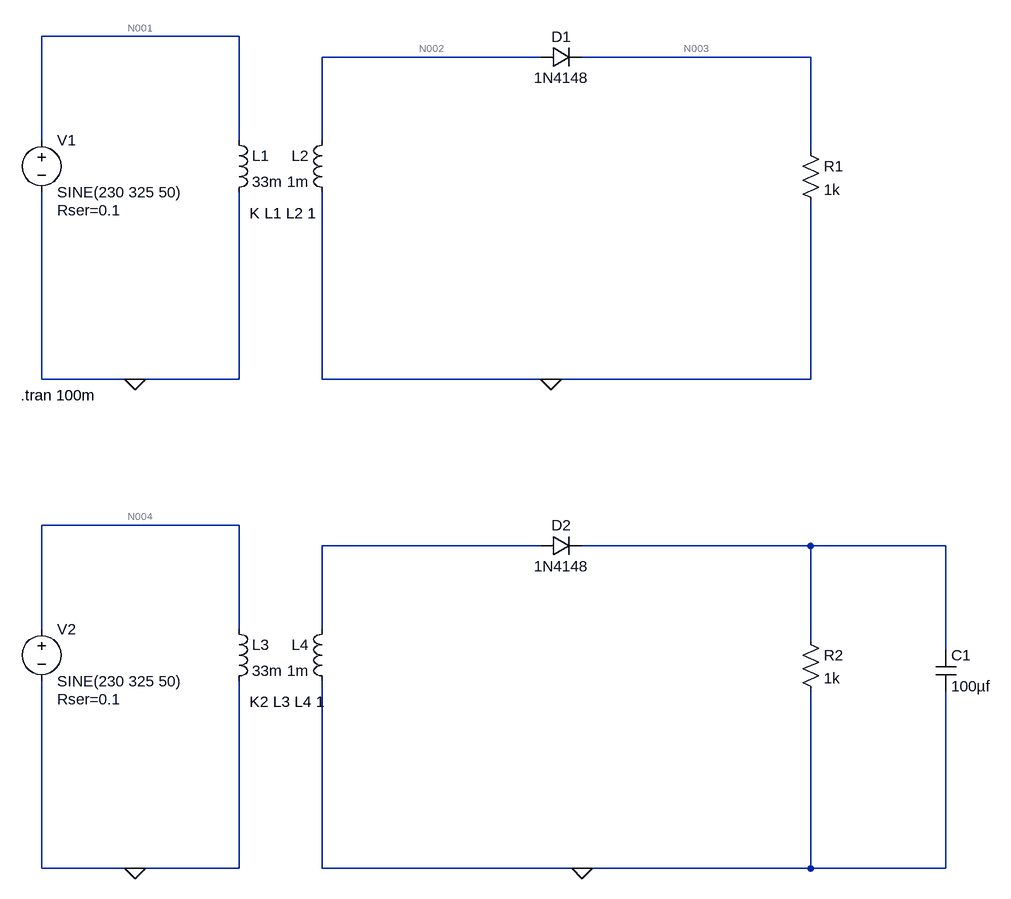
[diagram p0: schematic EXP1.asc]
EXP1.asc, the LTspice schematic file:
Version 4.1
SHEET 1 1164 1272
WIRE -16 -48 -320 -48
WIRE 448 -16 112 -16
WIRE 864 -16 512 -16
WIRE -320 112 -320 -48
WIRE -16 112 -16 -48
WIRE 112 112 112 -16
WIRE 864 128 864 -16
WIRE -320 480 -320 192
WIRE -176 480 -320 480
WIRE -16 480 -16 192
WIRE -16 480 -176 480
WIRE 112 480 112 192
WIRE 464 480 112 480
WIRE 864 480 864 208
WIRE 864 480 464 480
WIRE -16 704 -320 704
WIRE 448 736 112 736
WIRE 864 736 512 736
WIRE 1072 736 864 736
WIRE -320 864 -320 704
WIRE -16 864 -16 704
WIRE 112 864 112 736
WIRE 864 880 864 736
WIRE 1072 896 1072 736
WIRE -320 1232 -320 944
WIRE -176 1232 -320 1232
WIRE -16 1232 -16 944
WIRE -16 1232 -176 1232
WIRE 112 1232 112 944
WIRE 512 1232 112 1232
WIRE 864 1232 864 960
WIRE 864 1232 512 1232
WIRE 1072 1232 1072 960
WIRE 1072 1232 864 1232
FLAG -176 480 0
FLAG -176 1232 0
FLAG 464 480 0
FLAG 512 1232 0
SYMBOL ind -32 96 R0
SYMATTR InstName L1
SYMATTR Value 33m
SYMATTR Type ind
SYMBOL ind 128 96 M0
SYMATTR InstName L2
SYMATTR Value 1m
SYMATTR Type ind
SYMBOL voltage -320 96 R0
WINDOW 123 0 0 Left 0
WINDOW 39 24 124 Left 2
SYMATTR InstName V1
SYMATTR Value SINE(230 325 50)
SYMATTR SpiceLine Rser=0.1
SYMBOL res 848 112 R0
SYMATTR InstName R1
SYMATTR Value 1k
SYMBOL diode 448 0 R270
WINDOW 0 32 32 VTop 2
WINDOW 3 0 32 VBottom 2
SYMATTR InstName D1
SYMATTR Value 1N4148
SYMBOL ind -32 848 R0
SYMATTR InstName L3
SYMATTR Value 33m
SYMATTR Type ind
SYMBOL ind 128 848 M0
SYMATTR InstName L4
SYMATTR Value 1m
SYMATTR Type ind
SYMBOL voltage -320 848 R0
WINDOW 123 0 0 Left 0
WINDOW 39 24 124 Left 2
SYMATTR InstName V2
SYMATTR Value SINE(230 325 50)
SYMATTR SpiceLine Rser=0.1
SYMBOL res 848 864 R0
SYMATTR InstName R2
SYMATTR Value 1k
SYMBOL diode 448 752 R270
WINDOW 0 32 32 VTop 2
WINDOW 3 0 32 VBottom 2
SYMATTR InstName D2
SYMATTR Value 1N4148
SYMBOL cap 1056 896 R0
SYMATTR InstName C1
SYMATTR Value 100µf
TEXT 0 224 Left 2 !K L1 L2 1
TEXT -352 504 Left 2 !.tran 100m
TEXT 0 976 Left 2 !K2 L3 L4 1

The netlist it stands for:
* EXP1.asc
L1 N001 0 33m
L2 N002 0 1m
V1 N001 0 SINE(230 325 50) Rser=0.1
R1 N003 0 1k
D1 N002 N003 1N4148
L3 N004 0 33m
L4 N005 0 1m
V2 N004 0 SINE(230 325 50) Rser=0.1
R2 N006 0 1k
D2 N005 N006 1N4148
C1 N006 0 100µf
.model D D
.lib standard.dio
K L1 L2 1
.tran 100m
K2 L3 L4 1
.backanno
.end

* Results of the author's LTspice run, read from the files saved beside the schematic
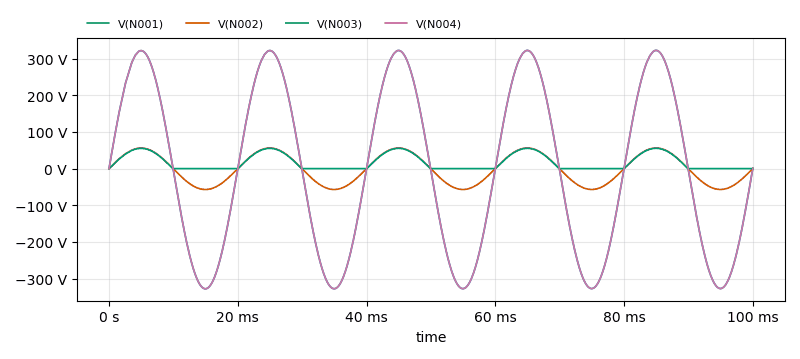
[diagram p1: Transient Analysis of EXP1.asc, plotted from the saved traces]
* Transient Analysis, 1 run:
*   V(N001): min -328 V, max 322.6 V, average -2.773 V, rms 229.7 V, last 819.4 mV
*   V(N002): min -57.09 V, max 56.15 V, average -482.7 mV, rms 39.99 V, last 142.6 mV
*   V(N003): min -642.2 µV, max 55.35 V, average 17.38 V, rms 27.48 V, last 705.4 µV
*   V(N004): min -328 V, max 322.6 V, average -2.774 V, rms 229.7 V, last 819.7 mV